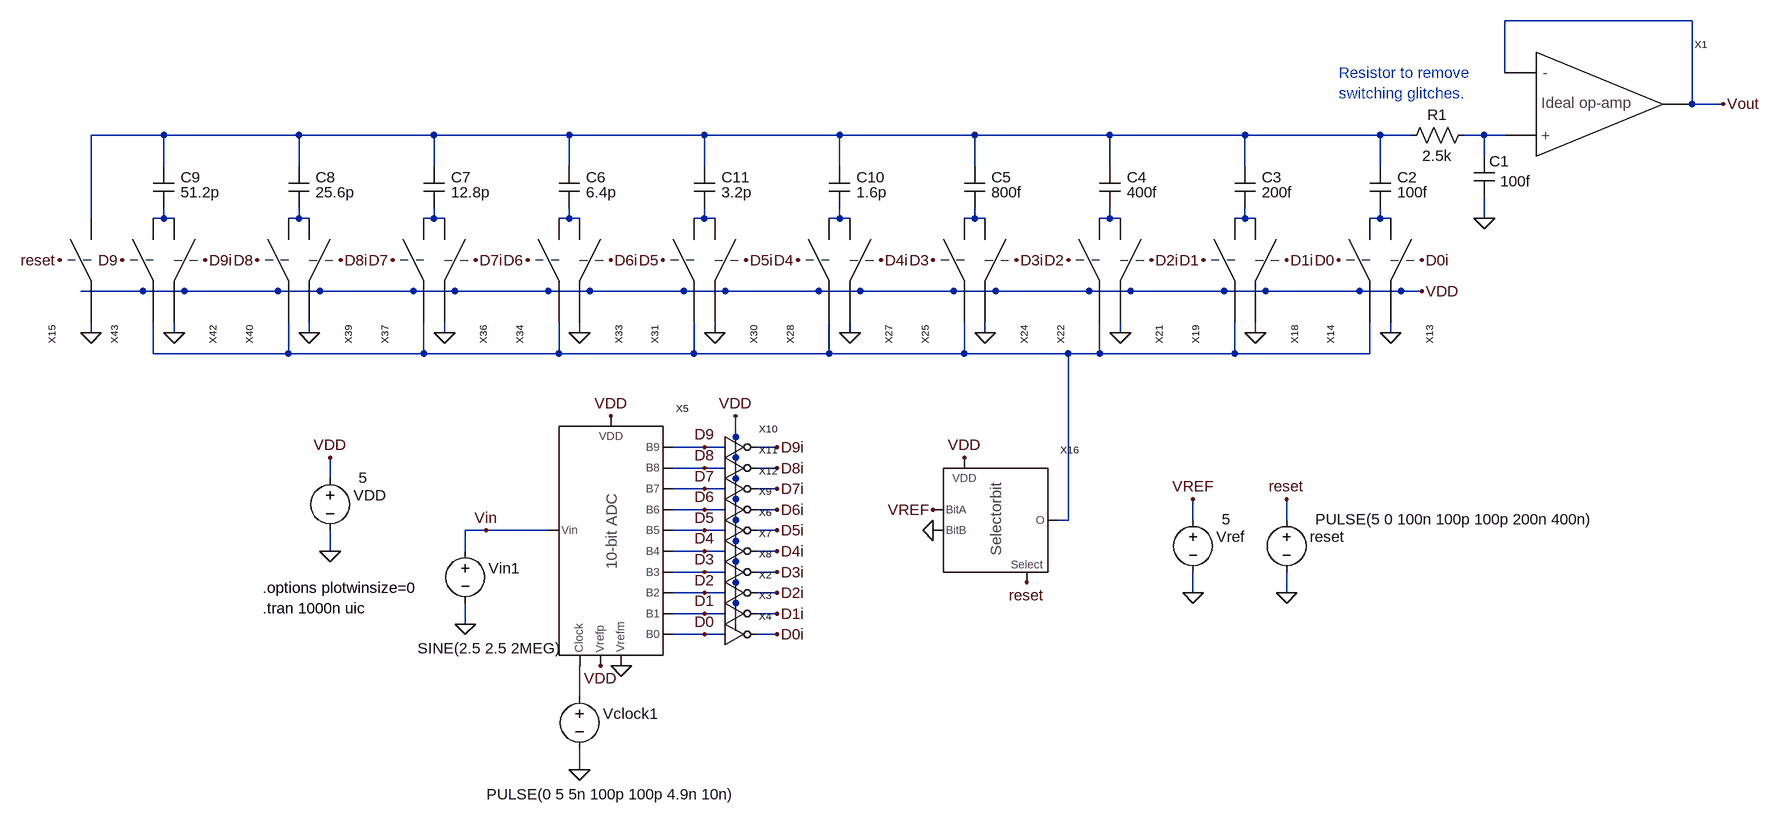
[diagram p0: schematic Fig29_12.asc]
Fig29_12.asc, the LTspice schematic file:
Version 4
SHEET 1 2492 2408
WIRE 2080 848 1792 848
WIRE 1792 928 1792 848
WIRE 2080 976 2080 848
WIRE 2128 976 2080 976
WIRE -272 1024 -384 1024
WIRE -64 1024 -272 1024
WIRE 144 1024 -64 1024
WIRE 352 1024 144 1024
WIRE 560 1024 352 1024
WIRE 768 1024 560 1024
WIRE 976 1024 768 1024
WIRE 1184 1024 976 1024
WIRE 1392 1024 1184 1024
WIRE 1600 1024 1392 1024
WIRE 1648 1024 1600 1024
WIRE 1760 1024 1728 1024
WIRE 1792 1024 1760 1024
WIRE 1760 1056 1760 1024
WIRE -272 1072 -272 1024
WIRE -64 1072 -64 1024
WIRE 144 1072 144 1024
WIRE 352 1072 352 1024
WIRE 560 1072 560 1024
WIRE 768 1072 768 1024
WIRE 976 1072 976 1024
WIRE 1184 1072 1184 1024
WIRE 1392 1072 1392 1024
WIRE 1600 1072 1600 1024
WIRE -384 1152 -384 1024
WIRE -272 1152 -272 1136
WIRE -272 1152 -288 1152
WIRE -256 1152 -272 1152
WIRE -64 1152 -64 1136
WIRE -64 1152 -80 1152
WIRE -48 1152 -64 1152
WIRE 144 1152 144 1136
WIRE 144 1152 128 1152
WIRE 160 1152 144 1152
WIRE 352 1152 352 1136
WIRE 352 1152 336 1152
WIRE 368 1152 352 1152
WIRE 560 1152 560 1136
WIRE 560 1152 544 1152
WIRE 576 1152 560 1152
WIRE 768 1152 768 1136
WIRE 768 1152 752 1152
WIRE 784 1152 768 1152
WIRE 976 1152 976 1136
WIRE 976 1152 960 1152
WIRE 992 1152 976 1152
WIRE 1184 1152 1184 1136
WIRE 1184 1152 1168 1152
WIRE 1200 1152 1184 1152
WIRE 1392 1152 1392 1136
WIRE 1392 1152 1376 1152
WIRE 1408 1152 1392 1152
WIRE 1600 1152 1600 1136
WIRE 1600 1152 1584 1152
WIRE 1616 1152 1600 1152
WIRE 1760 1152 1760 1120
WIRE -304 1264 -400 1264
WIRE -240 1264 -304 1264
WIRE -96 1264 -240 1264
WIRE -32 1264 -96 1264
WIRE 112 1264 -32 1264
WIRE 176 1264 112 1264
WIRE 320 1264 176 1264
WIRE 384 1264 320 1264
WIRE 528 1264 384 1264
WIRE 592 1264 528 1264
WIRE 736 1264 592 1264
WIRE 800 1264 736 1264
WIRE 944 1264 800 1264
WIRE 1008 1264 944 1264
WIRE 1152 1264 1008 1264
WIRE 1216 1264 1152 1264
WIRE 1360 1264 1216 1264
WIRE 1424 1264 1360 1264
WIRE 1568 1264 1424 1264
WIRE 1632 1264 1568 1264
WIRE 1664 1264 1632 1264
WIRE -384 1328 -384 1312
WIRE -256 1328 -256 1312
WIRE -48 1328 -48 1312
WIRE 160 1328 160 1312
WIRE 368 1328 368 1312
WIRE 576 1328 576 1312
WIRE 784 1328 784 1312
WIRE 992 1328 992 1312
WIRE 1200 1328 1200 1312
WIRE 1408 1328 1408 1312
WIRE 1616 1328 1616 1312
WIRE -288 1360 -288 1312
WIRE -80 1360 -80 1312
WIRE -80 1360 -288 1360
WIRE 128 1360 128 1312
WIRE 128 1360 -80 1360
WIRE 336 1360 336 1312
WIRE 336 1360 128 1360
WIRE 544 1360 544 1312
WIRE 544 1360 336 1360
WIRE 752 1360 752 1312
WIRE 752 1360 544 1360
WIRE 960 1360 960 1312
WIRE 960 1360 752 1360
WIRE 1120 1360 960 1360
WIRE 1168 1360 1168 1312
WIRE 1168 1360 1120 1360
WIRE 1376 1360 1376 1312
WIRE 1376 1360 1168 1360
WIRE 1584 1360 1584 1312
WIRE 1584 1360 1376 1360
WIRE 608 1488 608 1456
WIRE 560 1504 512 1504
WIRE 592 1504 560 1504
WIRE 672 1504 640 1504
WIRE 608 1520 608 1488
WIRE 560 1536 512 1536
WIRE 592 1536 560 1536
WIRE 672 1536 640 1536
WIRE -16 1552 -16 1520
WIRE 608 1552 608 1520
WIRE 560 1568 512 1568
WIRE 592 1568 560 1568
WIRE 672 1568 640 1568
WIRE 608 1584 608 1552
WIRE 560 1600 512 1600
WIRE 592 1600 560 1600
WIRE 672 1600 640 1600
WIRE 608 1616 608 1584
WIRE 1120 1616 1120 1360
WIRE 1120 1616 1104 1616
WIRE 1312 1616 1312 1584
WIRE 1456 1616 1456 1584
WIRE 224 1632 192 1632
WIRE 320 1632 224 1632
WIRE 560 1632 512 1632
WIRE 592 1632 560 1632
WIRE 672 1632 640 1632
WIRE 608 1648 608 1616
WIRE -16 1664 -16 1632
WIRE 192 1664 192 1632
WIRE 560 1664 512 1664
WIRE 592 1664 560 1664
WIRE 672 1664 640 1664
WIRE 608 1680 608 1648
WIRE 560 1696 512 1696
WIRE 592 1696 560 1696
WIRE 672 1696 640 1696
WIRE 608 1712 608 1680
WIRE 560 1728 512 1728
WIRE 592 1728 560 1728
WIRE 672 1728 640 1728
WIRE 1312 1728 1312 1696
WIRE 1456 1728 1456 1696
WIRE 608 1744 608 1712
WIRE 560 1760 512 1760
WIRE 592 1760 560 1760
WIRE 672 1760 640 1760
WIRE 192 1776 192 1744
WIRE 608 1776 608 1744
WIRE 560 1792 512 1792
WIRE 592 1792 560 1792
WIRE 672 1792 640 1792
WIRE 368 1888 368 1840
WIRE 368 2000 368 1968
FLAG -16 1664 0
FLAG -16 1520 VDD
FLAG 560 1792 D0
FLAG 560 1760 D1
FLAG 560 1728 D2
FLAG 672 1728 D2i
FLAG 672 1760 D1i
FLAG 672 1792 D0i
FLAG 416 1456 VDD
FLAG 368 2000 0
FLAG 432 1840 0
FLAG 400 1840 VDD
FLAG 192 1776 0
FLAG 224 1632 Vin
FLAG 1760 1152 0
FLAG 2128 976 Vout
FLAG 560 1696 D3
FLAG 560 1664 D4
FLAG 560 1632 D5
FLAG 672 1632 D5i
FLAG 672 1664 D4i
FLAG 672 1696 D3i
FLAG 560 1600 D6
FLAG 672 1600 D6i
FLAG 560 1568 D7
FLAG 560 1536 D8
FLAG 560 1504 D9
FLAG 608 1456 VDD
FLAG 672 1504 D9i
FLAG 672 1536 D8i
FLAG 672 1568 D7i
FLAG 1536 1216 D0
FLAG 1664 1216 D0i
FLAG 1616 1328 0
FLAG 1328 1216 D1
FLAG 1456 1216 D1i
FLAG 1408 1328 0
FLAG 1120 1216 D2
FLAG 1248 1216 D2i
FLAG 1200 1328 0
FLAG 912 1216 D3
FLAG 1040 1216 D3i
FLAG 992 1328 0
FLAG 704 1216 D4
FLAG 832 1216 D4i
FLAG 784 1328 0
FLAG 496 1216 D5
FLAG 624 1216 D5i
FLAG 576 1328 0
FLAG 288 1216 D6
FLAG 416 1216 D6i
FLAG 368 1328 0
FLAG 80 1216 D7
FLAG 208 1216 D7i
FLAG 160 1328 0
FLAG -128 1216 D8
FLAG 0 1216 D8i
FLAG -48 1328 0
FLAG -336 1216 D9
FLAG -208 1216 D9i
FLAG -256 1328 0
FLAG 1664 1264 VDD
FLAG -384 1328 0
FLAG -432 1216 reset
FLAG 960 1520 VDD
FLAG 1056 1712 reset
FLAG 912 1632 0
FLAG 912 1600 VREF
FLAG 1312 1728 0
FLAG 1312 1584 VREF
FLAG 1456 1728 0
FLAG 1456 1584 reset
SYMBOL voltage -16 1536 R0
WINDOW 0 36 42 Left 0
WINDOW 3 44 15 Left 0
WINDOW 123 0 0 Left 0
WINDOW 39 0 0 Left 0
SYMATTR InstName VDD
SYMATTR Value 5
SYMBOL inverter 592 1728 R0
SYMATTR InstName X2
SYMBOL inverter 592 1760 R0
SYMATTR InstName X3
SYMBOL inverter 592 1792 R0
SYMATTR InstName X4
SYMBOL voltage 368 1872 R0
WINDOW 0 36 42 Left 0
WINDOW 3 -143 166 Left 0
WINDOW 123 0 0 Left 0
WINDOW 39 0 0 Left 0
SYMATTR InstName Vclock1
SYMATTR Value PULSE(0 5 5n 100p 100p 4.9n 10n)
SYMBOL voltage 192 1648 R0
WINDOW 0 36 42 Left 0
WINDOW 3 -73 165 Left 0
WINDOW 123 0 0 Left 0
WINDOW 39 0 0 Left 0
SYMATTR InstName Vin1
SYMATTR Value SINE(2.5 2.5 2MEG)
SYMBOL Ideal_op_amp 1840 976 R0
SYMATTR InstName X1
SYMBOL Ideal_10_bit_ADC 336 1824 R0
SYMATTR InstName X5
SYMBOL inverter 592 1632 R0
SYMATTR InstName X6
SYMBOL inverter 592 1664 R0
SYMATTR InstName X7
SYMBOL inverter 592 1696 R0
SYMATTR InstName X8
SYMBOL inverter 592 1600 R0
SYMATTR InstName X9
SYMBOL inverter 592 1504 R0
SYMATTR InstName X10
SYMBOL inverter 592 1536 R0
SYMATTR InstName X11
SYMBOL inverter 592 1568 R0
SYMATTR InstName X12
SYMBOL switch_1 1600 1152 R90
SYMATTR InstName X13
SYMBOL switch_1 1600 1152 M90
SYMATTR InstName X14
SYMBOL switch_1 1392 1152 R90
SYMATTR InstName X18
SYMBOL switch_1 1392 1152 M90
SYMATTR InstName X19
SYMBOL switch_1 1184 1152 R90
SYMATTR InstName X21
SYMBOL switch_1 1184 1152 M90
SYMATTR InstName X22
SYMBOL switch_1 976 1152 R90
SYMATTR InstName X24
SYMBOL switch_1 976 1152 M90
SYMATTR InstName X25
SYMBOL switch_1 768 1152 R90
SYMATTR InstName X27
SYMBOL switch_1 768 1152 M90
SYMATTR InstName X28
SYMBOL switch_1 560 1152 R90
SYMATTR InstName X30
SYMBOL switch_1 560 1152 M90
SYMATTR InstName X31
SYMBOL switch_1 352 1152 R90
SYMATTR InstName X33
SYMBOL switch_1 352 1152 M90
SYMATTR InstName X34
SYMBOL switch_1 144 1152 R90
SYMATTR InstName X36
SYMBOL switch_1 144 1152 M90
SYMATTR InstName X37
SYMBOL switch_1 -64 1152 R90
SYMATTR InstName X39
SYMBOL switch_1 -64 1152 M90
SYMATTR InstName X40
SYMBOL switch_1 -272 1152 R90
SYMATTR InstName X42
SYMBOL switch_1 -272 1152 M90
SYMATTR InstName X43
SYMBOL cap 1744 1056 R0
WINDOW 3 41 39 Left 0
SYMATTR Value 100f
SYMATTR InstName C1
SYMBOL cap 1584 1072 R0
WINDOW 0 42 17 Left 0
WINDOW 3 42 40 Left 0
SYMATTR InstName C2
SYMATTR Value 100f
SYMBOL cap 1376 1072 R0
WINDOW 0 42 17 Left 0
WINDOW 3 42 40 Left 0
SYMATTR InstName C3
SYMATTR Value 200f
SYMBOL cap 1168 1072 R0
WINDOW 0 42 17 Left 0
WINDOW 3 42 40 Left 0
SYMATTR InstName C4
SYMATTR Value 400f
SYMBOL cap 960 1072 R0
WINDOW 0 42 17 Left 0
WINDOW 3 42 40 Left 0
SYMATTR InstName C5
SYMATTR Value 800f
SYMBOL cap 336 1072 R0
WINDOW 0 42 17 Left 0
WINDOW 3 42 40 Left 0
SYMATTR InstName C6
SYMATTR Value 6.4p
SYMBOL cap 128 1072 R0
WINDOW 0 42 17 Left 0
WINDOW 3 42 40 Left 0
SYMATTR InstName C7
SYMATTR Value 12.8p
SYMBOL cap -80 1072 R0
WINDOW 0 42 17 Left 0
WINDOW 3 42 40 Left 0
SYMATTR InstName C8
SYMATTR Value 25.6p
SYMBOL cap -288 1072 R0
WINDOW 0 42 17 Left 0
WINDOW 3 42 40 Left 0
SYMATTR InstName C9
SYMATTR Value 51.2p
SYMBOL cap 752 1072 R0
WINDOW 0 42 17 Left 0
WINDOW 3 42 40 Left 0
SYMATTR InstName C10
SYMATTR Value 1.6p
SYMBOL cap 544 1072 R0
WINDOW 0 42 17 Left 0
WINDOW 3 42 40 Left 0
SYMATTR InstName C11
SYMATTR Value 3.2p
SYMBOL switch_1 -368 1152 M90
SYMATTR InstName X15
SYMBOL Selectorbit 928 1696 R0
SYMATTR InstName X16
SYMBOL voltage 1312 1600 R0
WINDOW 0 36 42 Left 0
WINDOW 3 44 15 Left 0
WINDOW 123 0 0 Left 0
WINDOW 39 0 0 Left 0
SYMATTR InstName Vref
SYMATTR Value 5
SYMBOL voltage 1456 1600 R0
WINDOW 0 36 42 Left 0
WINDOW 3 44 15 Left 0
WINDOW 123 0 0 Left 0
WINDOW 39 0 0 Left 0
SYMATTR InstName reset
SYMATTR Value PULSE(5 0 100n 100p 100p 200n 400n)
SYMBOL res 1632 1040 R270
WINDOW 0 32 56 VTop 0
WINDOW 3 0 56 VBottom 0
SYMATTR InstName R1
SYMATTR Value 2.5k
TEXT -120 1752 Left 0 !.tran 1000n uic
TEXT -120 1720 Left 0 !.options plotwinsize=0
TEXT 1536 928 Left 0 ;Resistor to remove \nswitching glitches.

The netlist it stands for:
* Fig29_12.asc
VDD VDD 0 5
XX2 D2 D2i VDD inverter  ; pins In Out VDD
XX3 D1 D1i VDD inverter  ; pins In Out VDD
XX4 D0 D0i VDD inverter  ; pins In Out VDD
Vclock1 N014 0 PULSE(0 5 5n 100p 100p 4.9n 10n)
Vin1 Vin 0 SINE(2.5 2.5 2MEG)
XX1 Vout N002 Vout Ideal_op_amp  ; pins Vinm Vinp Out
XX5 D0 D1 D2 D3 D4 D5 D6 D7 D8 D9 Vin VDD 0 N014 VDD Ideal_10_bit_ADC  ; pins B0 B1 B2 B3 B4 B5 B6 B7 B8 B9 Vin Vrefp Vrefm Clock VDD
XX6 D5 D5i VDD inverter  ; pins In Out VDD
XX7 D4 D4i VDD inverter  ; pins In Out VDD
XX8 D3 D3i VDD inverter  ; pins In Out VDD
XX9 D6 D6i VDD inverter  ; pins In Out VDD
XX10 D9 D9i VDD inverter  ; pins In Out VDD
XX11 D8 D8i VDD inverter  ; pins In Out VDD
XX12 D7 D7i VDD inverter  ; pins In Out VDD
XX13 N012 0 D0i VDD switch_1  ; pins P1 P2 clk VDD
XX14 N012 N013 D0 VDD switch_1  ; pins P1 P2 clk VDD
XX18 N011 0 D1i VDD switch_1  ; pins P1 P2 clk VDD
XX19 N011 N013 D1 VDD switch_1  ; pins P1 P2 clk VDD
XX21 N010 0 D2i VDD switch_1  ; pins P1 P2 clk VDD
XX22 N010 N013 D2 VDD switch_1  ; pins P1 P2 clk VDD
XX24 N009 0 D3i VDD switch_1  ; pins P1 P2 clk VDD
XX25 N009 N013 D3 VDD switch_1  ; pins P1 P2 clk VDD
XX27 N008 0 D4i VDD switch_1  ; pins P1 P2 clk VDD
XX28 N008 N013 D4 VDD switch_1  ; pins P1 P2 clk VDD
XX30 N007 0 D5i VDD switch_1  ; pins P1 P2 clk VDD
XX31 N007 N013 D5 VDD switch_1  ; pins P1 P2 clk VDD
XX33 N006 0 D6i VDD switch_1  ; pins P1 P2 clk VDD
XX34 N006 N013 D6 VDD switch_1  ; pins P1 P2 clk VDD
XX36 N005 0 D7i VDD switch_1  ; pins P1 P2 clk VDD
XX37 N005 N013 D7 VDD switch_1  ; pins P1 P2 clk VDD
XX39 N004 0 D8i VDD switch_1  ; pins P1 P2 clk VDD
XX40 N004 N013 D8 VDD switch_1  ; pins P1 P2 clk VDD
XX42 N003 0 D9i VDD switch_1  ; pins P1 P2 clk VDD
XX43 N003 N013 D9 VDD switch_1  ; pins P1 P2 clk VDD
C1 N002 0 100f
C2 N001 N012 100f
C3 N001 N011 200f
C4 N001 N010 400f
C5 N001 N009 800f
C6 N001 N006 6.4p
C7 N001 N005 12.8p
C8 N001 N004 25.6p
C9 N001 N003 51.2p
C10 N001 N008 1.6p
C11 N001 N007 3.2p
XX15 N001 0 reset VDD switch_1  ; pins P1 P2 clk VDD
XX16 VREF 0 N013 reset VDD Selectorbit  ; pins BitA BitB O Select VDD
Vref VREF 0 5
V§reset reset 0 PULSE(5 0 100n 100p 100p 200n 400n)
R1 N001 N002 2.5k
.tran 1000n uic
.options plotwinsize=0
* Resistor to remove
* switching glitches.
.backanno
.end